# Altium schematic sheet Sheet1.SchDoc
size A4
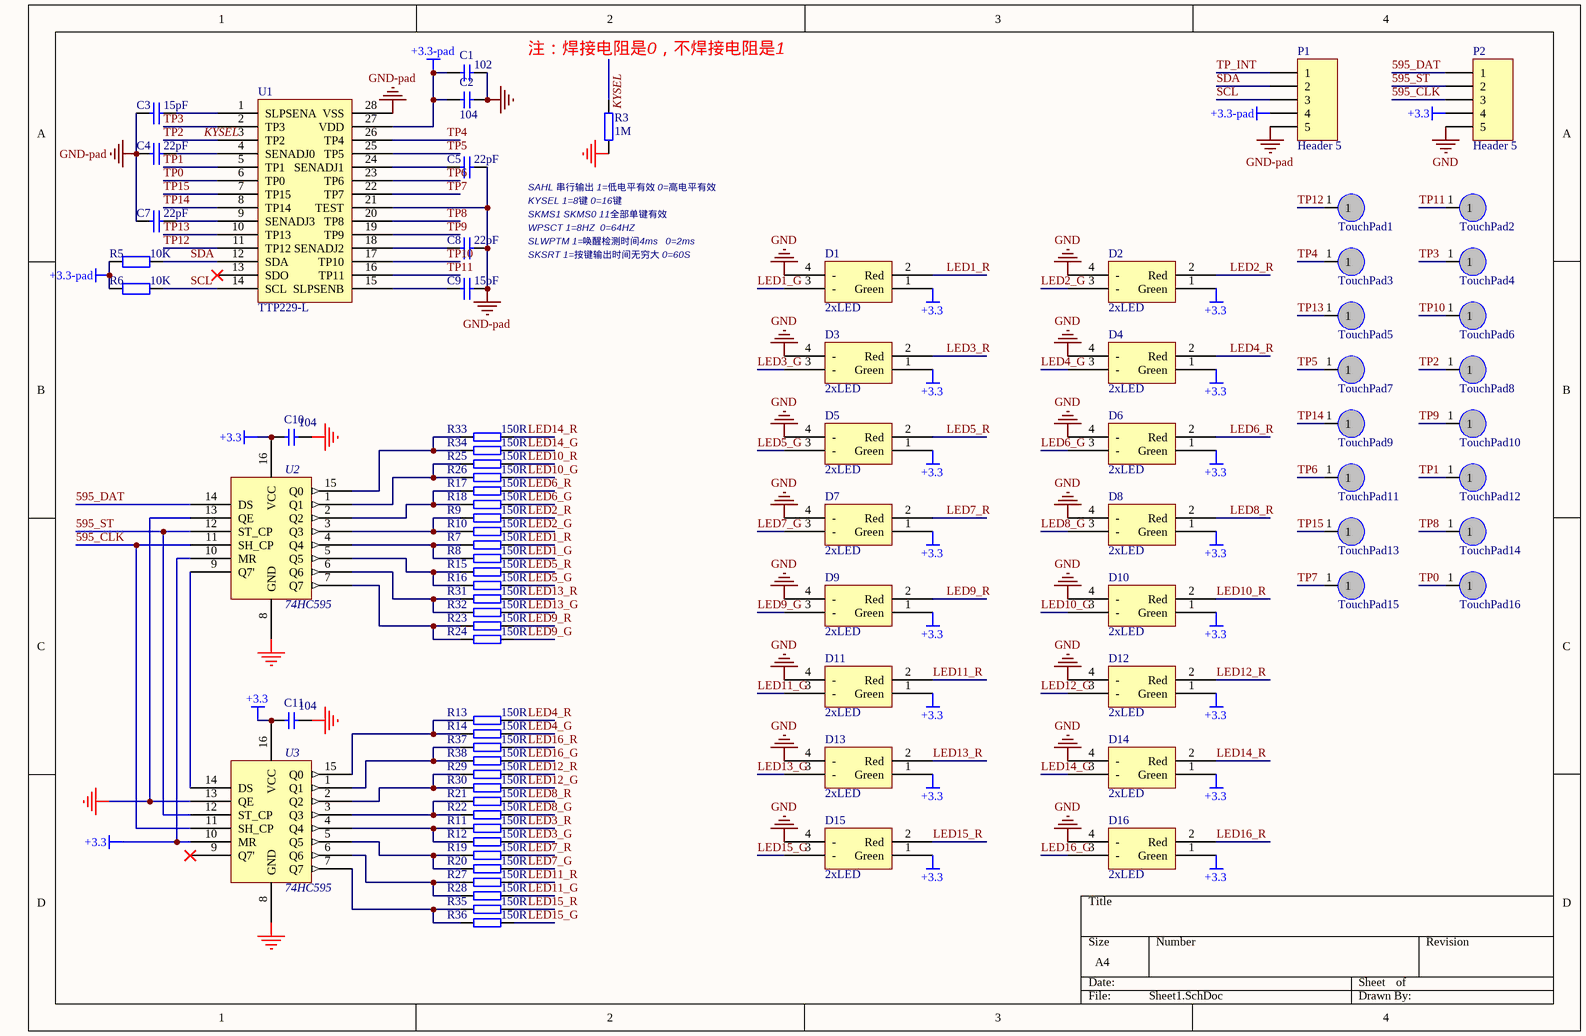
[diagram p0: Sheet1.SchDoc]

## Parts
C1  102  [0603p]
C2  104  [0603p]
C3  15pF  [0603p]
C4  22pF  [0603p]
C5  22pF  [0603p]
C7  22pF  [0603p]
C8  22pF  [0603p]
C9  15pF  [0603p]
C10  104  [0603p]
C11  104  [0603p]
D1  2xLED  [LED]
D2  2xLED  [LED]
D3  2xLED  [LED]
D4  2xLED  [LED]
D5  2xLED  [LED]
D6  2xLED  [LED]
D7  2xLED  [LED]
D8  2xLED  [LED]
D9  2xLED  [LED]
D10  2xLED  [LED]
D11  2xLED  [LED]
D12  2xLED  [LED]
D13  2xLED  [LED]
D14  2xLED  [LED]
D15  2xLED  [LED]
D16  2xLED  [LED]
P1  Header 5  [XH-5P-2.54]
P2  Header 5  [XH-5P-2.54]
R3  1M  [0603p]
R5  10K  [0603p]
R6  10K  [0603p]
R7  150R  [0603p]
R8  150R  [0603p]
R9  150R  [0603p]
R10  150R  [0603p]
R11  150R  [0603p]
R12  150R  [0603p]
R13  150R  [0603p]
R14  150R  [0603p]
R15  150R  [0603p]
R16  150R  [0603p]
R17  150R  [0603p]
R18  150R  [0603p]
R19  150R  [0603p]
R20  150R  [0603p]
R21  150R  [0603p]
R22  150R  [0603p]
R23  150R  [0603p]
R24  150R  [0603p]
R25  150R  [0603p]
R26  150R  [0603p]
R27  150R  [0603p]
R28  150R  [0603p]
R29  150R  [0603p]
R30  150R  [0603p]
R31  150R  [0603p]
R32  150R  [0603p]
R33  150R  [0603p]
R34  150R  [0603p]
R35  150R  [0603p]
R36  150R  [0603p]
R37  150R  [0603p]
R38  150R  [0603p]
TouchPad1  TouchPad  [TOUCHKEYBIG]  (value not drawn)
TouchPad2  TouchPad  [TouchKey]  (value not drawn)
TouchPad3  TouchPad  [TouchKey]  (value not drawn)
TouchPad4  TouchPad  [TOUCHKEY]  (value not drawn)
TouchPad5  TouchPad  [TOUCHKEYBIG]  (value not drawn)
TouchPad6  TouchPad  [TouchKey]  (value not drawn)
TouchPad7  TouchPad  [TouchKey]  (value not drawn)
TouchPad8  TouchPad  [TOUCHKEY]  (value not drawn)
TouchPad9  TouchPad  [TOUCHKEYBIG]  (value not drawn)
TouchPad10  TouchPad  [TouchKey]  (value not drawn)
TouchPad11  TouchPad  [TouchKey]  (value not drawn)
TouchPad12  TouchPad  [TOUCHKEY]  (value not drawn)
TouchPad13  TouchPad  [TOUCHKEYBIG]  (value not drawn)
TouchPad14  TouchPad  [TouchKey]  (value not drawn)
TouchPad15  TouchPad  [TOUCHKEY]  (value not drawn)
TouchPad16  TouchPad  [TOUCHKEY]  (value not drawn)
U1  TTP229-L  [LC-SSOP-28_150mil]
U2  74HC595  [LC-SOP-16_150mil]
U3  74HC595  [LC-SOP-16_150mil]

## Nets
+3.3: C10.1 C11.1 D1.1(Green) D2.1(Green) D3.1(Green) D4.1(Green) D5.1(Green) D6.1(Green) D7.1(Green) D8.1(Green) D9.1(Green) D10.1(Green) D11.1(Green) D12.1(Green) D13.1(Green) D14.1(Green) D15.1(Green) D16.1(Green) P2.4 U2.10(MR) U2.16(VCC) U3.10(MR) U3.16(VCC)
+3.3-pad: C1.1 C2.1 P1.4 R5.1 R6.1 U1.27(VDD)
GND: C10.2 C11.2 D1.4(-) D2.4(-) D3.4(-) D4.4(-) D5.4(-) D6.4(-) D7.4(-) D8.4(-) D9.4(-) D10.4(-) D11.4(-) D12.4(-) D13.4(-) D14.4(-) D15.4(-) D16.4(-) P2.5 U2.8(GND) U2.13(QE) U3.8(GND) U3.13(QE)
GND-pad: C1.2 C2.2 C3.1 C4.1 C5.2 C7.1 C8.2 C9.2 P1.5 R3.2 U1.21(TEST) U1.28(VSS)
595_CLK: P2.3 U2.11(SH_CP) U3.11(SH_CP)
595_DAT: P2.1 U2.14(DS)
595_ST: P2.2 U2.12(ST_CP) U3.12(ST_CP)
KYSEL: R3.1 TouchPad8.1 U1.3(TP2)  [also labelled TP2]
LED1_G: D1.3(-) R8.2
LED1_R: D1.2(Red) R7.2
LED2_G: D2.3(-) R10.2
LED2_R: D2.2(Red) R9.2
LED3_G: D3.3(-) R12.2
LED3_R: D3.2(Red) R11.2
LED4_G: D4.3(-) R14.2
LED4_R: D4.2(Red) R13.2
LED5_G: D5.3(-) R16.2
LED5_R: D5.2(Red) R15.2
LED6_G: D6.3(-) R18.2
LED6_R: D6.2(Red) R17.2
LED7_G: D7.3(-) R20.2
LED7_R: D7.2(Red) R19.2
LED8_G: D8.3(-) R22.2
LED8_R: D8.2(Red) R21.2
LED9_G: D9.3(-) R24.2
LED9_R: D9.2(Red) R23.2
LED10_G: D10.3(-) R26.2
LED10_R: D10.2(Red) R25.2
LED11_G: D11.3(-) R28.2
LED11_R: D11.2(Red) R27.2
LED12_G: D12.3(-) R30.2
LED12_R: D12.2(Red) R29.2
LED13_G: D13.3(-) R32.2
LED13_R: D13.2(Red) R31.2
LED14_G: D14.3(-) R34.2
LED14_R: D14.2(Red) R33.2
LED15_G: D15.3(-) R36.2
LED15_R: D15.2(Red) R35.2
LED16_G: D16.3(-) R38.2
LED16_R: D16.2(Red) R37.2
SCL: P1.3 R6.2 U1.14(SCL)
SDA: P1.2 R5.2 U1.12(SDA)
TP0: TouchPad16.1 U1.6(TP0)
TP1: TouchPad12.1 U1.5(TP1)
TP3: TouchPad4.1 U1.2(TP3)
TP4: TouchPad3.1 U1.26(TP4)
TP5: TouchPad7.1 U1.25(TP5)
TP6: TouchPad11.1 U1.23(TP6)
TP7: TouchPad15.1 U1.22(TP7)
TP8: TouchPad14.1 U1.20(TP8)
TP9: TouchPad10.1 U1.19(TP9)
TP10: TouchPad6.1 U1.17(TP10)
TP11: TouchPad2.1 U1.16(TP11)
TP12: TouchPad1.1 U1.11(TP12)
TP13: TouchPad5.1 U1.10(TP13)
TP14: TouchPad9.1 U1.8(TP14)
TP15: TouchPad13.1 U1.7(TP15)
TP_INT: P1.1
NetC3_2: C3.2 U1.1(SLPSENA)
NetC4_2: C4.2 U1.4(SENADJ0)
NetC5_1: C5.1 U1.24(SENADJ1)
NetC7_2: C7.2 U1.9(SENADJ3)
NetC8_1: C8.1 U1.18(SENADJ2)
NetC9_1: C9.1 U1.15(SLPSENB)
NetR7_1: R7.1 R8.1 U2.4(Q4)
NetR9_1: R9.1 R10.1 U2.3(Q3)
NetR11_1: R11.1 R12.1 U3.4(Q4)
NetR13_1: R13.1 R14.1 U3.15(Q0)
NetR15_1: R15.1 R16.1 U2.5(Q5)
NetR17_1: R17.1 R18.1 U2.2(Q2)
NetR19_1: R19.1 R20.1 U3.5(Q5)
NetR21_1: R21.1 R22.1 U3.3(Q3)
NetR23_1: R23.1 R24.1 U2.7(Q7)
NetR25_1: R25.1 R26.1 U2.1(Q1)
NetR27_1: R27.1 R28.1 U3.6(Q6)
NetR29_1: R29.1 R30.1 U3.2(Q2)
NetR31_1: R31.1 R32.1 U2.6(Q6)
NetR33_1: R33.1 R34.1 U2.15(Q0)
NetR35_1: R35.1 R36.1 U3.7(Q7)
NetR37_1: R37.1 R38.1 U3.1(Q1)
NetU2_9: U2.9(Q7') U3.14(DS)

Not connected (* = marked no-connect by the designer): U1 13(SDO)*; U3 9(Q7')*

## Notes on the sheet
- 注：焊接电阻是0，不焊接电阻是1
- SAHL 串行输出 1=低电平有效 0=高电平有效
- KYSEL 1=8键 0=16键
- SKMS1 SKMS0 11全部单键有效
- WPSCT 1=8HZ  0=64HZ
- SLWPTM 1=唤醒检测时间4ms   0=2ms
- SKSRT 1=按键输出时间无穷大 0=60S

## Library data of the parts
C1 C2 C10 C11 = 电容-NPO-0603: 0603/NPO
C3 C5 C7-C9 = Cap: Capacitor; Published: 8-Jun-2000; LatestRevisionDate: 17-Jul-2002; LatestRevisionNote: Re-released for DXP Platform.; PackageReference: RAD-0.3; Publisher: Altium Limited
  C3 C9: Value: 15pF
  C5 C7 C8: Value: 22pF
C4 = Cap: Capacitor; Value: 15pF; Published: 8-Jun-2000; LatestRevisionDate: 17-Jul-2002; LatestRevisionNote: Re-released for DXP Platform.; PackageReference: RAD-0.3; Publisher: Altium Limited
P1 P2 = Header 5: Header, 5-Pin; LatestRevisionDate: 17-Jul-2002; LatestRevisionNote: Re-released for DXP Platform.; Publisher: Altium Limited
R3 R7 R9-R15 R17-R23 R25-R31 R33-R38 = 电阻-0603: 0603/0.1000w/75v; 产品规格: 0603
R5 R6 = Res2: Resistor; Published: 8-Jun-2000; LatestRevisionDate: 17-Jul-2002; LatestRevisionNote: Re-released for DXP Platform.; PackageReference: AXIAL-0.4; Publisher: Altium Limited; Value: 10K
R8 R16 R24 R32 = 电阻-0603: 0603/0.1000w/75v; 产品规格: *
U2 U3 = 74HCT595